# EAGLE design BT AQ DOL STTM R1 (EAGLE 9.6.2)
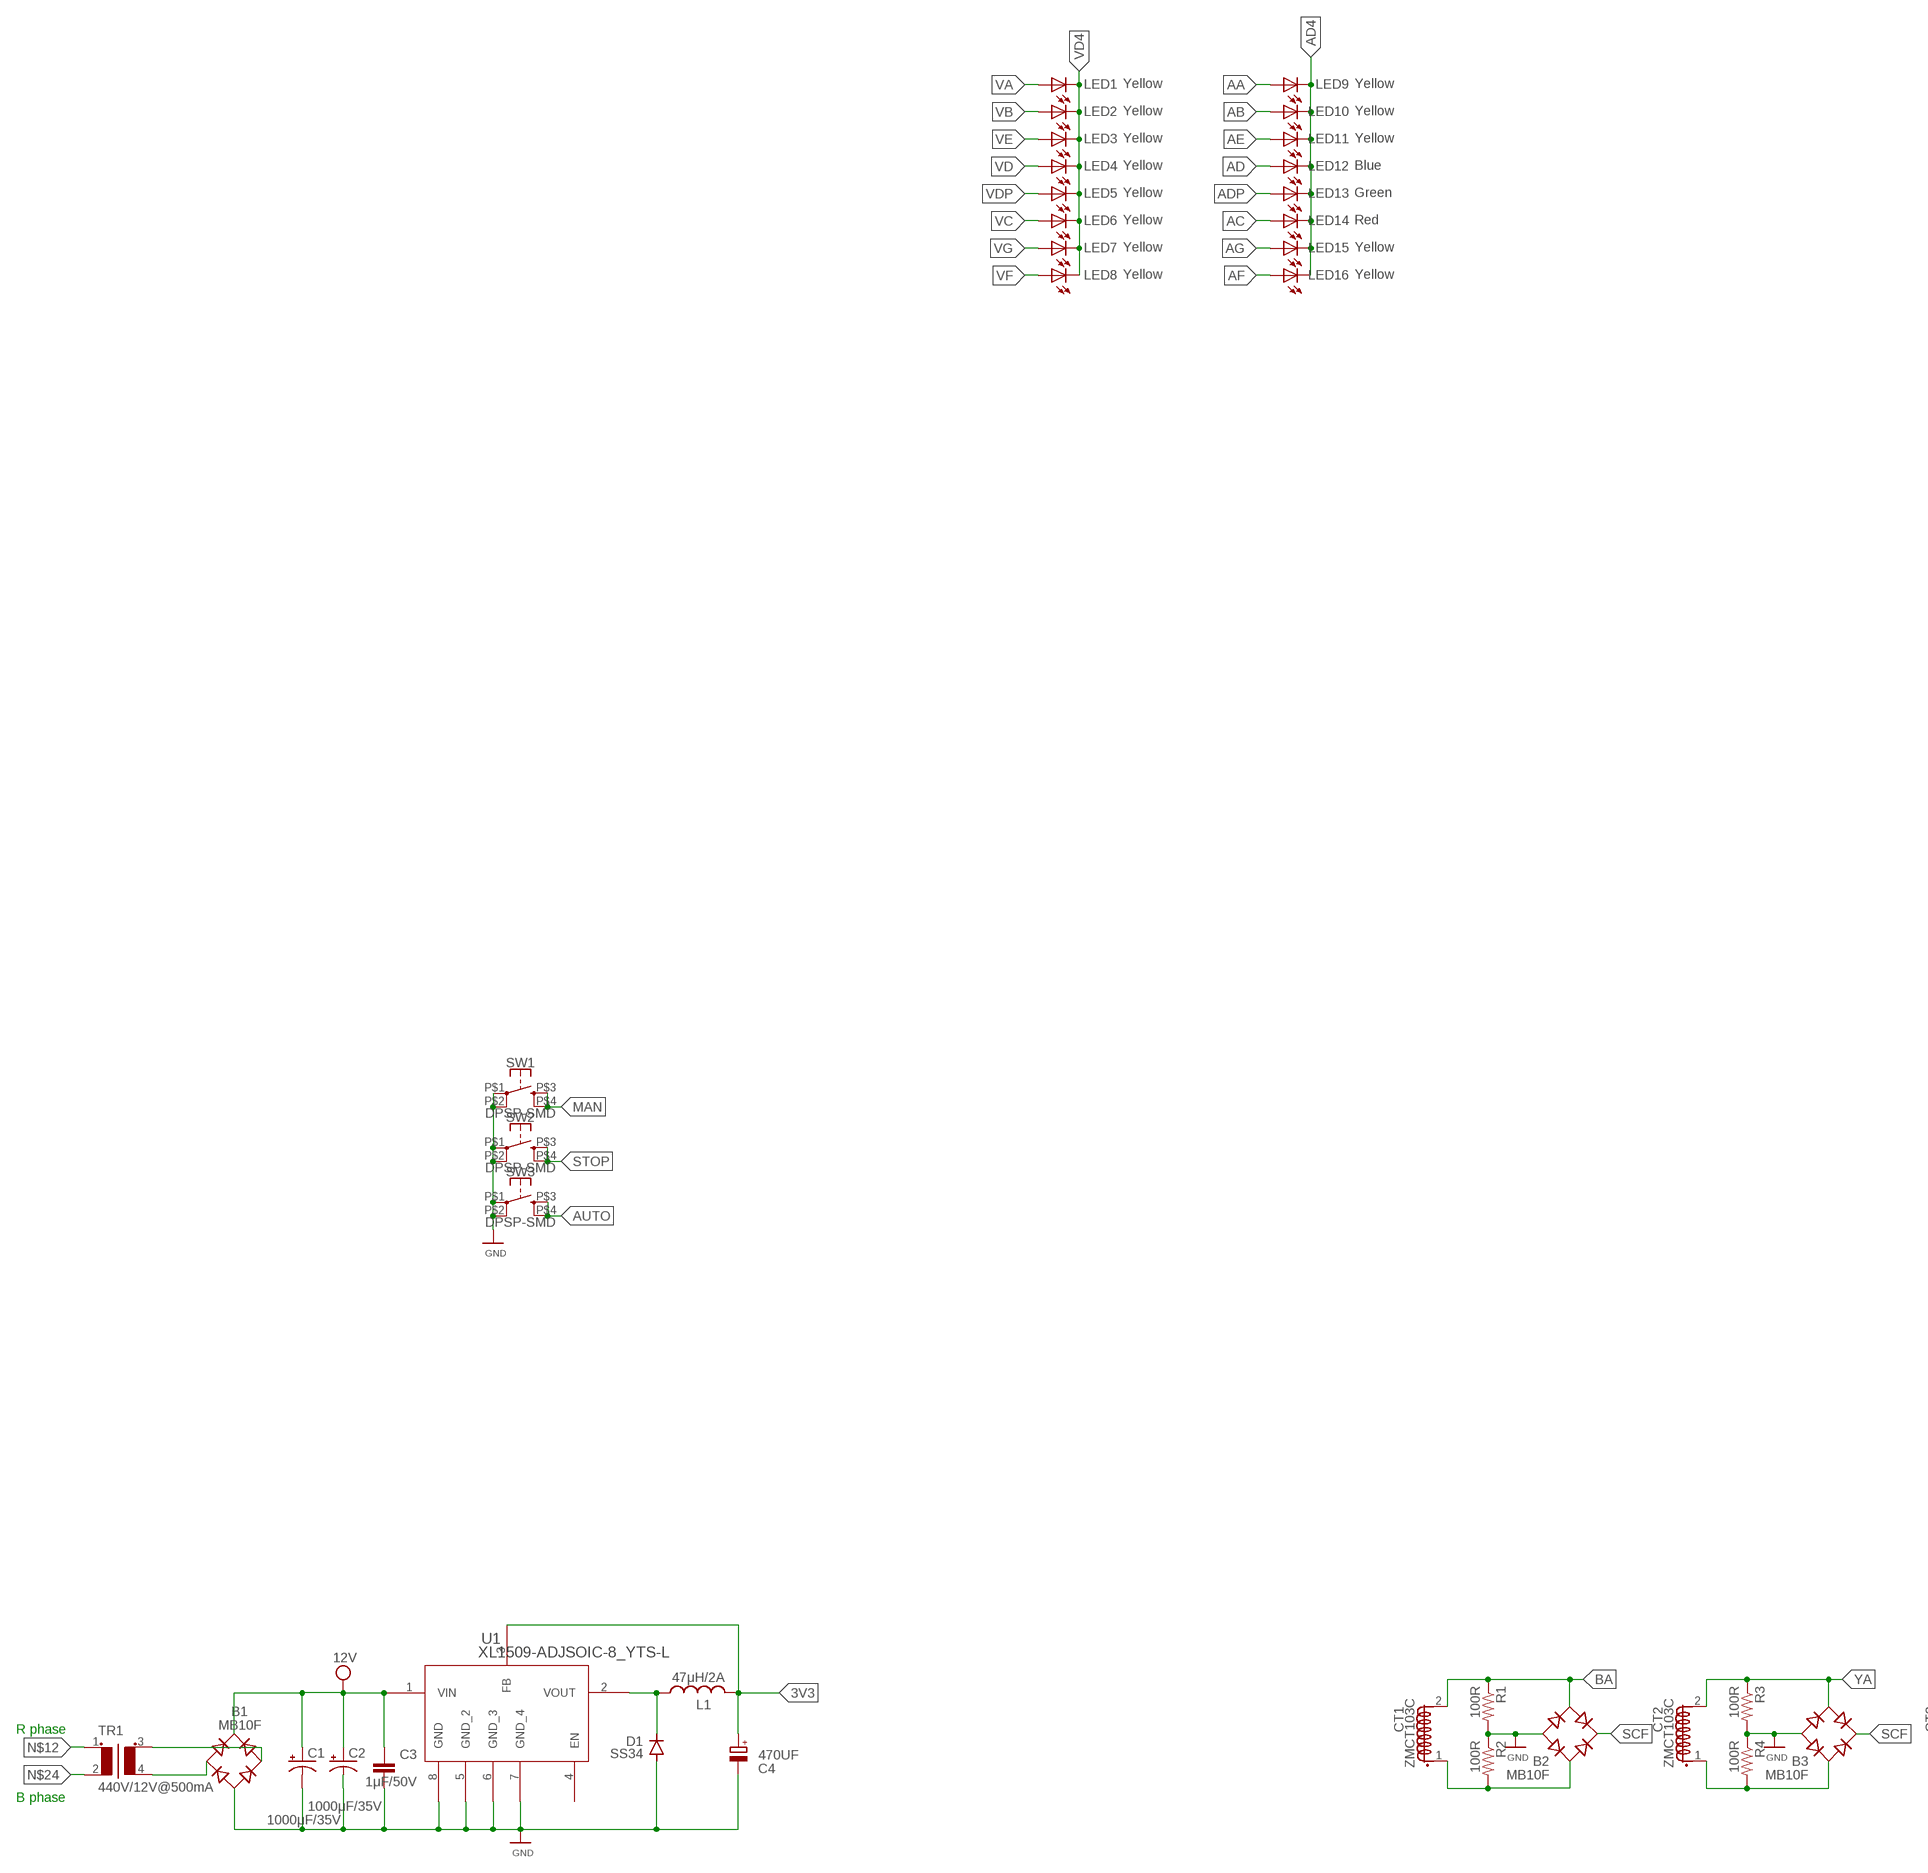
[diagram p0: schematic, sheet 1, part 1 of 2]
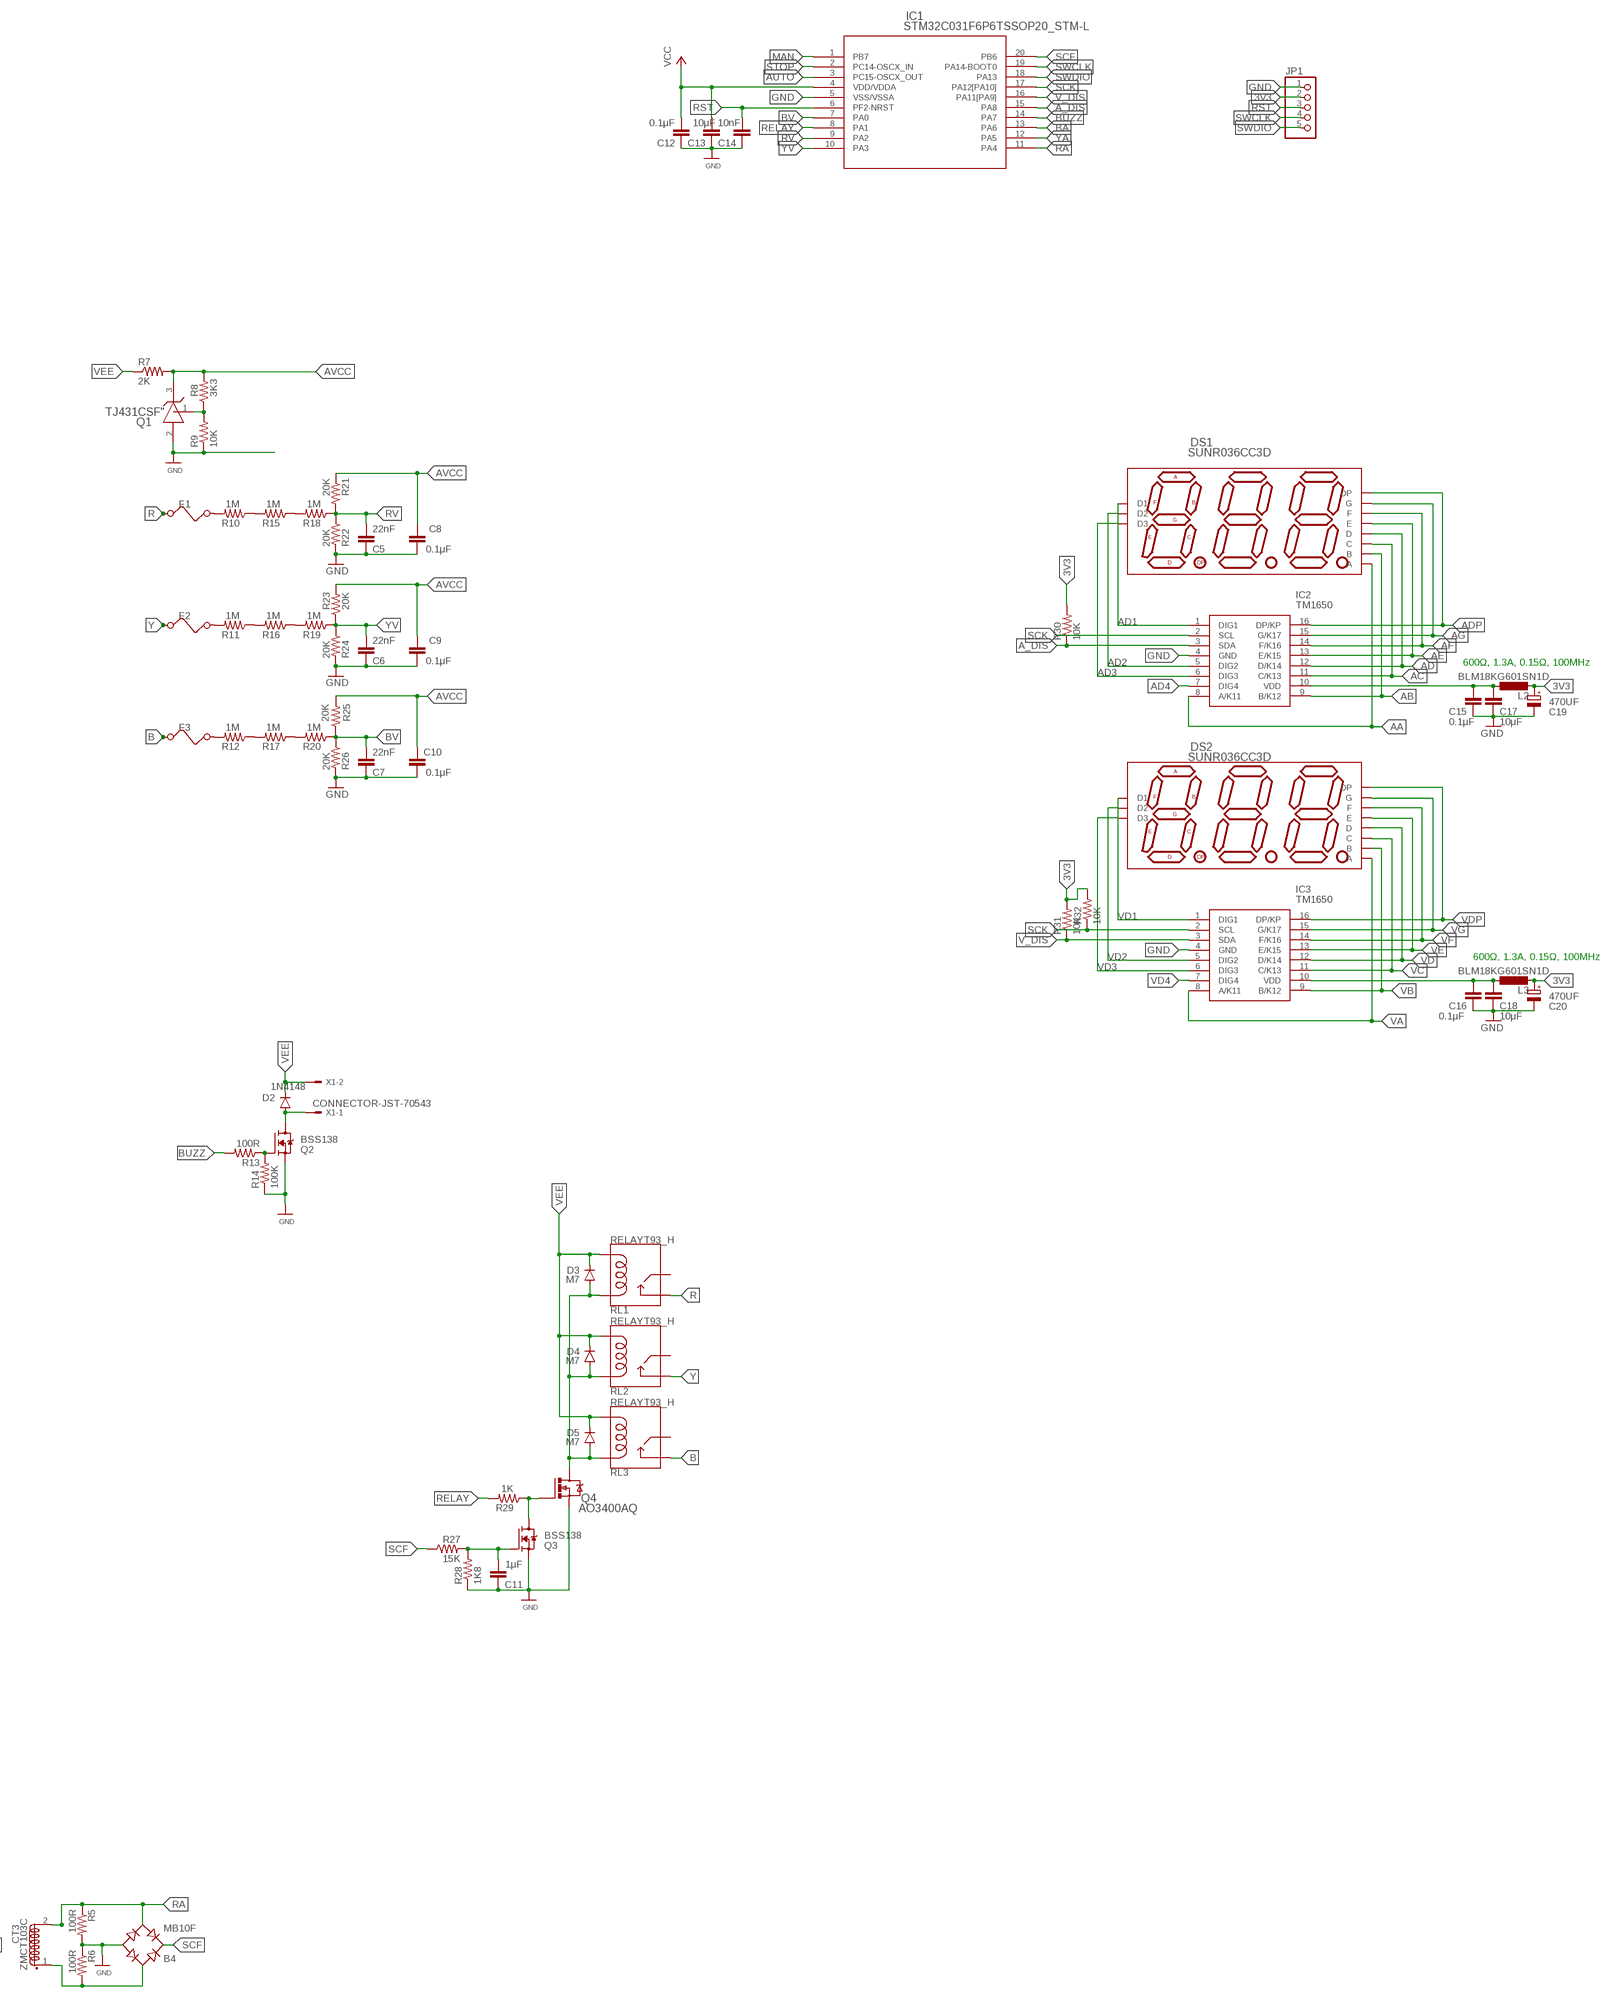
[diagram p1: schematic, sheet 1, part 2 of 2]

## Parts
B1  MB10F  MB8S  [SOIC-4]
B2  MB10F  MB8S  [SOIC-4]
B3  MB10F  MB8S  [SOIC-4]
B4  MB10F  MB8S  [SOIC-4]
C1  1000μF/35V  CPOL-USE5-13  [E5-13]
C2  1000μF/35V  CPOL-USE5-13  [E5-13]
C3  1μF/50V  C-EUC0603K  [C0603K]
C4  470UF  CPOL-EUE3.5-8  [E3,5-8]
C5  22nF  CC1206  [C1206]
C6  22nF  CC1206  [C1206]
C7  22nF  CC1206  [C1206]
C8  0.1μF  CC1206  [C1206]
C9  0.1μF  CC1206  [C1206]
C10  0.1μF  CC1206  [C1206]
C11  1μF  CC1206  [C1206]
C12  0.1μF  C-EUC0603K  [C0603K]
C13  10μF  C-EUC0805K  [C0805K]
C14  10nF  CC1206  [C1206]
C15  0.1μF  C-EUC0603K  [C0603K]
C16  0.1μF  C-EUC0603K  [C0603K]
C17  10μF  C-EUC0805K  [C0805K]
C18  10μF  C-EUC0805K  [C0805K]
C19  470UF  CPOL-EUE3.5-8  [E3,5-8]
C20  470UF  CPOL-EUE3.5-8  [E3,5-8]
CT1  ZMCT103C  CT18X10  [ZMCT103C]
CT2  ZMCT103C  CT18X10  [ZMCT103C]
CT3  ZMCT103C  CT18X10  [ZMCT103C]
D1  SS34  DIODE-DO214AC  [DO214AC]
D2  1N4148  DIODE-MINIMELF  [MINIMELF]
D3  M7  DIODE-DO214AC  [DO214AC]
D4  M7  DIODE-DO214AC  [DO214AC]
D5  M7  DIODE-DO214AC  [DO214AC]
DS1  SUNR036CC3D  7SEGMENT_3DIGIT_DISPLAYDIP  [7S3D036_DIP]
DS2  SUNR036CC3D  7SEGMENT_3DIGIT_DISPLAYDIP  [7S3D036_DIP]
F1  FUSESMD  [WIRE_FUSE]
F2  FUSESMD  [WIRE_FUSE]
F3  FUSESMD  [WIRE_FUSE]
IC1  STM32C031F6P6TSSOP20_STM-L  [TSSOP20_STM-L]
IC2  TM1650  [SOIC127P604X185-16N]
IC3  TM1650  [SOIC127P604X185-16N]
JP1  PINHD-1X5  [1X05]
L1  47μH/2A  INDUCTORL5650M  [L5650M]
L2  BLM18KG601SN1D  L-EUL2012C  [L2012C]
L3  BLM18KG601SN1D  L-EUL2012C  [L2012C]
LED1  Yellow  LED3MM  [LED3MM]
LED2  Yellow  LED3MM  [LED3MM]
LED3  Yellow  LED3MM  [LED3MM]
LED4  Yellow  LED3MM  [LED3MM]
LED5  Yellow  LED3MM  [LED3MM]
LED6  Yellow  LED3MM  [LED3MM]
LED7  Yellow  LED3MM  [LED3MM]
LED8  Yellow  LED3MM  [LED3MM]
LED9  Yellow  LED3MM  [LED3MM]
LED10  Yellow  LED3MM  [LED3MM]
LED11  Yellow  LED3MM  [LED3MM]
LED12  Blue  LED3MM  [LED3MM]
LED13  Green  LED3MM  [LED3MM]
LED14  Red  LED3MM  [LED3MM]
LED15  Yellow  LED3MM  [LED3MM]
LED16  Yellow  LED3MM  [LED3MM]
Q1  TJ431CSF"  [SOT-23]
Q2  BSS138  [SOT95P240X111-3N]
Q3  BSS138  [SOT95P240X111-3N]
Q4  AO3400AQ  [SOT-23-DSG]
R1  100R  R-US_M1206  [M1206]
R2  100R  R-US_M1206  [M1206]
R3  100R  R-US_M1206  [M1206]
R4  100R  R-US_M1206  [M1206]
R5  100R  R-US_M1206  [M1206]
R6  100R  R-US_M1206  [M1206]
R7  2K  R-US_M1206  [M1206]
R8  3K3  R-US_M1206  [M1206]
R9  10K  R-US_M1206  [M1206]
R10  1M  R-US_M1206  [M1206]
R11  1M  R-US_M1206  [M1206]
R12  1M  R-US_M1206  [M1206]
R13  100R  R-US_M1206  [M1206]
R14  100K  R-US_M1206  [M1206]
R15  1M  R-US_M1206  [M1206]
R16  1M  R-US_M1206  [M1206]
R17  1M  R-US_M1206  [M1206]
R18  1M  R-US_M1206  [M1206]
R19  1M  R-US_M1206  [M1206]
R20  1M  R-US_M1206  [M1206]
R21  20K  R-US_M1206  [M1206]
R22  20K  R-US_M1206  [M1206]
R23  20K  R-US_M1206  [M1206]
R24  20K  R-US_M1206  [M1206]
R25  20K  R-US_M1206  [M1206]
R26  20K  R-US_M1206  [M1206]
R27  15K  R-US_M1206  [M1206]
R28  1K8  R-US_M1206  [M1206]
R29  1K  R-US_M1206  [M1206]
R30  10K  R-US_M1206  [M1206]
R31  10K  R-US_M1206  [M1206]
R32  10K  R-US_M1206  [M1206]
RL1  RELAYT93_H  [T93_H]
RL2  RELAYT93_H  [T93_H]
RL3  RELAYT93_H  [T93_H]
SW1  DPSP-SMD  [B3F-40XX-ROUND-SMD]
SW2  DPSP-SMD  [B3F-40XX-ROUND-SMD]
SW3  DPSP-SMD  [B3F-40XX-ROUND-SMD]
TR1  440V/12V@500mA  TRANSFORMER6VA  [440V12V6VA]
U1  XL1509-ADJSOIC-8_YTS-L  [SOIC-8_YTS-L]
X1  CONNECTOR-JST-70543  [70543-02]

## Nets
3V3: C4.+ C12.2 C13.2 C19.+ C20.+ IC1.4(VDD/VDDA) JP1.2 L1.2 L2.2 L3.2 R30.2 R31.2 R32.2 U1.3(FB) ; supply symbol labelled VCC
A_DIS: IC1.15(PA8) IC2.3(SDA) R30.1
AA: DS1.11(A) IC2.8(A/K11) LED9.A
AB: DS1.7(B) IC2.9(B/K12) LED10.A
AC: DS1.4(C) IC2.11(C/K13) LED14.A
AD: DS1.2(D) IC2.12(D/K14) LED12.A
AD1: DS1.12(D1) IC2.1(DIG1)
AD2: DS1.9(D2) IC2.5(DIG2)
AD3: DS1.8(D3) IC2.6(DIG3)
AD4: IC2.7(DIG4) LED9.K(C) LED10.K(C) LED11.K(C) LED12.K(C) LED13.K(C) LED14.K(C) LED15.K(C) LED16.K(C)
ADP: DS1.3(DP) IC2.16(DP/KP) LED13.A
AE: DS1.1(E) IC2.13(E/K15) LED11.A
AF: DS1.10(F) IC2.14(F/K16) LED16.A
AG: DS1.5(G) IC2.15(G/K17) LED15.A
AUTO: IC1.3(PC15-OSCX_OUT) SW3.P$3 SW3.P$4
AVCC: C8.2 C9.2 C10.2 Q1.3(CATHODE) R7.2 R8.2 R21.1 R23.2 R25.2
B: F3.1 RL3.14(N0)
BA: B2.~2(AC2) CT1.2(S1.2) IC1.13(PA6) R1.1
BUZZ: IC1.14(PA7) R13.2
BV: C7.2 IC1.7(PA0) R20.1 R25.1 R26.1
GND: B1.- B2.- B3.- B4.- C1.- C2.- C3.1 C4.- C5.1 C6.1 C7.1 C8.1 C9.1 C10.1 C11.1 C12.1 C13.1 C14.2 C15.1 C16.1 C17.1 C18.1 C19.- C20.- D1.A IC1.5(VSS/VSSA) IC2.4(GND) IC3.4(GND) JP1.1 Q1.2(ANODE) Q2.2(S) Q3.2(S) Q4.S R1.2 R2.1 R3.2 R4.1 R5.2 R6.1 R9.1 R14.1 R22.2 R24.2 R26.2 R28.1 SW1.P$1 SW1.P$2 SW2.P$1 SW2.P$2 SW3.P$1 SW3.P$2 U1.5(GND_2) U1.6(GND_3) U1.7(GND_4) U1.8(GND)
MAN: IC1.1(PB7) SW1.P$3 SW1.P$4
N$1: R15.1 R18.2
N$2 [VEE]: B1.~1(AC1) TR1.4(S2)
N$3: C15.2 C17.2 IC2.10(VDD) L2.1
N$4: Q2.1(G) R13.1 R14.2
N$5: R17.1 R20.2
N$6: Q3.3(D) Q4.G R29.1
N$8: C16.2 C18.2 IC3.10(VDD) L3.1
N$9: D2.A Q2.3(D) X1.1
N$10 [VEE]: B1.~2(AC2) TR1.3(S1)
N$11: R10.1 R15.2
N$12: F1.2 R10.2 TR1.1
N$14: R11.1 R16.2
N$15: R12.1 R17.2
N$16: B2.~1(AC1) CT1.1(S1.1) R2.2
N$17 [VEE]: D3.A D4.A D5.A Q4.D RL1.A1(COIL1) RL2.A1(COIL1) RL3.A1(COIL1)
N$19: R16.1 R19.2
N$20: D1.C L1.1 U1.2(VOUT)
N$21: Q1.1(REF) R8.1 R9.2
N$22: F2.2 R11.2
N$24: F3.2 R12.2 TR1.2
N$25: C11.2 Q3.1(G) R27.2 R28.2
N$27: B3.~1(AC1) CT2.1(S1.1) R4.2
N$62: B4.~1(AC1) CT3.1(S1.1) R6.2
R: F1.1 RL1.14(N0)
RA: B4.~2(AC2) CT3.2(S1.2) IC1.11(PA4) R5.1
RELAY: IC1.8(PA1) R29.2
RST: C14.1 IC1.6(PF2-NRST) JP1.3
RV: C5.2 IC1.9(PA2) R18.1 R21.2 R22.1
SCF: B2.+ B3.+ B4.+ IC1.20(PB6) R27.1
SCK: IC1.17(PA12[PA10]) IC2.2(SCL) IC3.2(SCL) R32.1
STOP: IC1.2(PC14-OSCX_IN) SW2.P$3 SW2.P$4
SWCLK: IC1.19(PA14-BOOT0) JP1.4
SWDIO: IC1.18(PA13) JP1.5
V_DIS: IC1.16(PA11[PA9]) IC3.3(SDA) R31.1
VA: DS2.11(A) IC3.8(A/K11) LED1.A
VB: DS2.7(B) IC3.9(B/K12) LED2.A
VC: DS2.4(C) IC3.11(C/K13) LED6.A
VD: DS2.2(D) IC3.12(D/K14) LED4.A
VD1: DS2.12(D1) IC3.1(DIG1)
VD2: DS2.9(D2) IC3.5(DIG2)
VD3: DS2.8(D3) IC3.6(DIG3)
VD4: IC3.7(DIG4) LED1.K(C) LED2.K(C) LED3.K(C) LED4.K(C) LED5.K(C) LED6.K(C) LED7.K(C) LED8.K(C)
VDP: DS2.3(DP) IC3.16(DP/KP) LED5.A
VE: DS2.1(E) IC3.13(E/K15) LED3.A
VEE [VEE]: B1.+ C1.+ C2.+ C3.2 D2.C D3.C D4.C D5.C R7.1 RL1.A2(COIL2) RL2.A2(COIL2) RL3.A2(COIL2) U1.1(VIN) X1.2 ; supply symbol labelled 12V
VF: DS2.10(F) IC3.14(F/K16) LED8.A
VG: DS2.5(G) IC3.15(G/K17) LED7.A
Y: F2.1 RL2.14(N0)
YA: B3.~2(AC2) CT2.2(S1.2) IC1.12(PA5) R3.1
YV: C6.2 IC1.10(PA3) R19.1 R23.1 R24.1
Unconnected: RL1.11(MAIN) RL2.11(MAIN) RL3.11(MAIN) U1.4(EN)

## Notes on the sheet
- 600Ω, 1.3A, 0.15Ω, 100MHz
- 600Ω, 1.3A, 0.15Ω, 100MHz
- R phase
- B phase

## Library data of the parts
B1-B4 = rectifier:MB*S: Bridge Rectifier Source: http://www.fairchildsemi.com/ds/MB/MB6S.pdf
C1 C2 = User Components:CPOL-US: POLARIZED CAPACITOR, American symbol
C3 C12 C13 C15-C18 = rcl:C-EU: CAPACITOR, European symbol; SPICEPREFIX: C
C4 C19 C20 = rcl:CPOL-EU: POLARIZED CAPACITOR, European symbol; SPICEPREFIX: C
C5-C11 C14 = eagle-ltspice:C: CAPACITOR, European symbol; SPICEMODEL: NONE; SPICEPREFIX: C
CT1-CT3 = User Components:CT
D1-D5 = diode:DIODE-: DIODE
DS1 DS2 = User Components:7SEGMENT_3DIGIT_DISPLAY
F1-F3 = User Components:FUSE: FUSE 5 x 20 mm
IC1 = User Components:STM32C031F6P6; COPYRIGHT: Copyright (C) 2026 Ultra Librarian. All rights reserved.; DATASHEET: https://www.st.com/resource/en/datasheet/stm32c031c4.pdf; DESCRIPTION: Mainstream Arm Cortex-M0+ MCU with 32 Kbytes of Flash memory, 12 Kbytes RAM, 48 MHz CPU, 2x USART, timers, ADC, comm. I/F, 2-3.6V; MANUFACTURER_NAME: STMicroelectronics; MANUFACTURER_PART_NUMBER: STM32C031F6P6
IC2 IC3 = User Components:TM1650: The TM1650 is a dedicated LED (LED display) drive control circuit with a keyboard scan interface. The MCU input and output control digital interface, data latch, LED driver, keyboard scan, brightness adjustment and other circuits are integrated inside. The TM1650's stable performance, reliable quality, and high immunity to interference make it suitable for long-term continuous operation in 24 hours Source: Datasheet <http://www.titanmec.com/index.php/en/product/download/id/540.html>; DESCRIPTION: The TM1650 is a dedicated LED (LED display) drive control circuit with a keyboard scan interface. The MCU input and output control digital interface, data latch, LED driver, keyboard scan, brightness adjustment and other circuits are integrated inside. The TM1650's stable performance, reliable quality, and high immunity to interference make it suitable for long-term continuous operation in 24 hours; HEIGHT: 1.85mm; MANUFACTURER_NAME: TITAN MICRO ELECTRONICS; MANUFACTURER_PART_NUMBER: tm1650
JP1 = User Components:PINHD-1X5: PIN HEADER
L1 = User Components:INDUCTOR: INDUCTOR, American symbol; SPICEPREFIX: L
L2 L3 = rcl:L-EU: INDUCTOR, European symbol; SPICEPREFIX: L
LED1-LED16 = adafruit:LED: LED OSRAM: - CHIPLED LG R971, LG N971, LY N971, LG Q971, LY Q971, LO R971, LY R971 LH N974, LH R974 LS Q976, LO Q976, LY Q976 LO Q996 - Hyper CHIPLED LW Q18S LB Q993, LB Q99A, LB R99A - SideLED LS A670, LO A670, LY A670, LG A670, LP A670 LB A673, LV A673, LT A673, LW A673 LH A674 LY A675 LS A676, LA A676, LO A676, LY A676, LW A676 LS A679, LY A679, LG A679 - Hyper Micro SIDELED® LS Y876, LA Y876, LO Y876, LY Y876 LT Y87S - SmartLED LW L88C, LW L88S LB L89C, LB L89S, LG L890 LS L89K, LO L89K, LY L89K LS L896, LA L896, LO L896, LY L896 - TOPLED LS T670, LO T670, LY T670, LG T670, LP T670 LSG T670, LSP T670, LSY T670, LOP T670, LYG T670 LG T671, LOG T671, LSG T671 LB T673, LV T673, LT T673, LW T673 LH T674 LS T676, LA T676, LO T676, LY T676, LB T676, LH T676, LSB T676, LW T676 LB T67C, LV T67C, LT T67C, LS T67K, LO T67K, LY T67K, LW E67C LS E67B, LA E67B, LO E67B, LY E67B, LB E67C, LV E67C, LT E67C LW T67C LS T679, LY T679, LG T679 LS T770, LO T770, LY T770, LG T770, LP T770 LB T773, LV T773, LT T773, LW T773 LH T774 LS E675, LA E675, LY E675, LS T675 LS T776, LA T776, LO T776, LY T776, LB T776 LHGB T686 LT T68C, LB T68C - Hyper Mini TOPLED® LB M676 - Mini TOPLED Santana® LG M470 LS M47K, LO M47K, LY M47K Source: http://www.osram.convergy.de/
Q1 = User Components:TJ431CSF; COPYRIGHT: Copyright (C) 2022 Ultra Librarian. All rights reserved.; MANUFACTURER_PART_NUMBER: TL431IDBZTG4; MFR_NAME: Texas Instruments; REFDES: RefDes; TYPE: TYPE
Q2 Q3 = User Components:BSS138: Check availability <https://pricing.snapeda.com/parts/BSS138/onsemi/view-part?ref=eda>; AVAILABILITY: In Stock; CHECK_PRICES: https://www.snapeda.com/parts/BSS138/Onsemi/view-part/?ref=eda; DESCRIPTION: N-Channel 50 V 220mA (Ta) 350mW (Ta) Surface Mount SOT-23-3; MF: onsemi; MP: BSS138; PACKAGE: SOT-23-3 ON Semiconductor; PRICE: None; SNAPEDA_LINK: https://www.snapeda.com/parts/BSS138/Onsemi/view-part/?ref=snap
Q4 = User Components:AO3400A; COPYRIGHT: Copyright (C) 2024 Ultra Librarian. All rights reserved.; MANUFACTURER_PART_NUMBER: AO3400A; MFR_NAME: Alpha and Omega Semiconductor
R1-R9 R14 R27 R28 = rcl:R-US_: RESISTOR, American symbol
R10-R13 R15-R26 R29-R32 = rcl:R-US_: RESISTOR, American symbol; SPICEPREFIX: R
RL1-RL3 = User Components:RELAY
SW1-SW3 = User Components:DPSP-SMD
TR1 = User Components:TRANSFORMER
U1 = User Components:XL1509-ADJ; COPYRIGHT: Copyright (C) 2026 Ultra Librarian. All rights reserved.; MANUFACTURER_NAME: UMW(Youtai Semiconductor Co., Ltd.); MANUFACTURER_PART_NUMBER: XL1509-ADJ
X1 = User Components:CONNECTOR-JST: CONNECTOR wire to board 2.54 mm (0.100") pitch header; MF: MOLEX; OC_FARNELL: unknown; OC_NEWARK: unknown

## Net classes
0 default: width 0.254 mm, drill 0.508 mm, clearance 0.33 mm
1 VEE: width 0.508 mm, drill 0.508 mm, clearance 0.762 mm

## Board
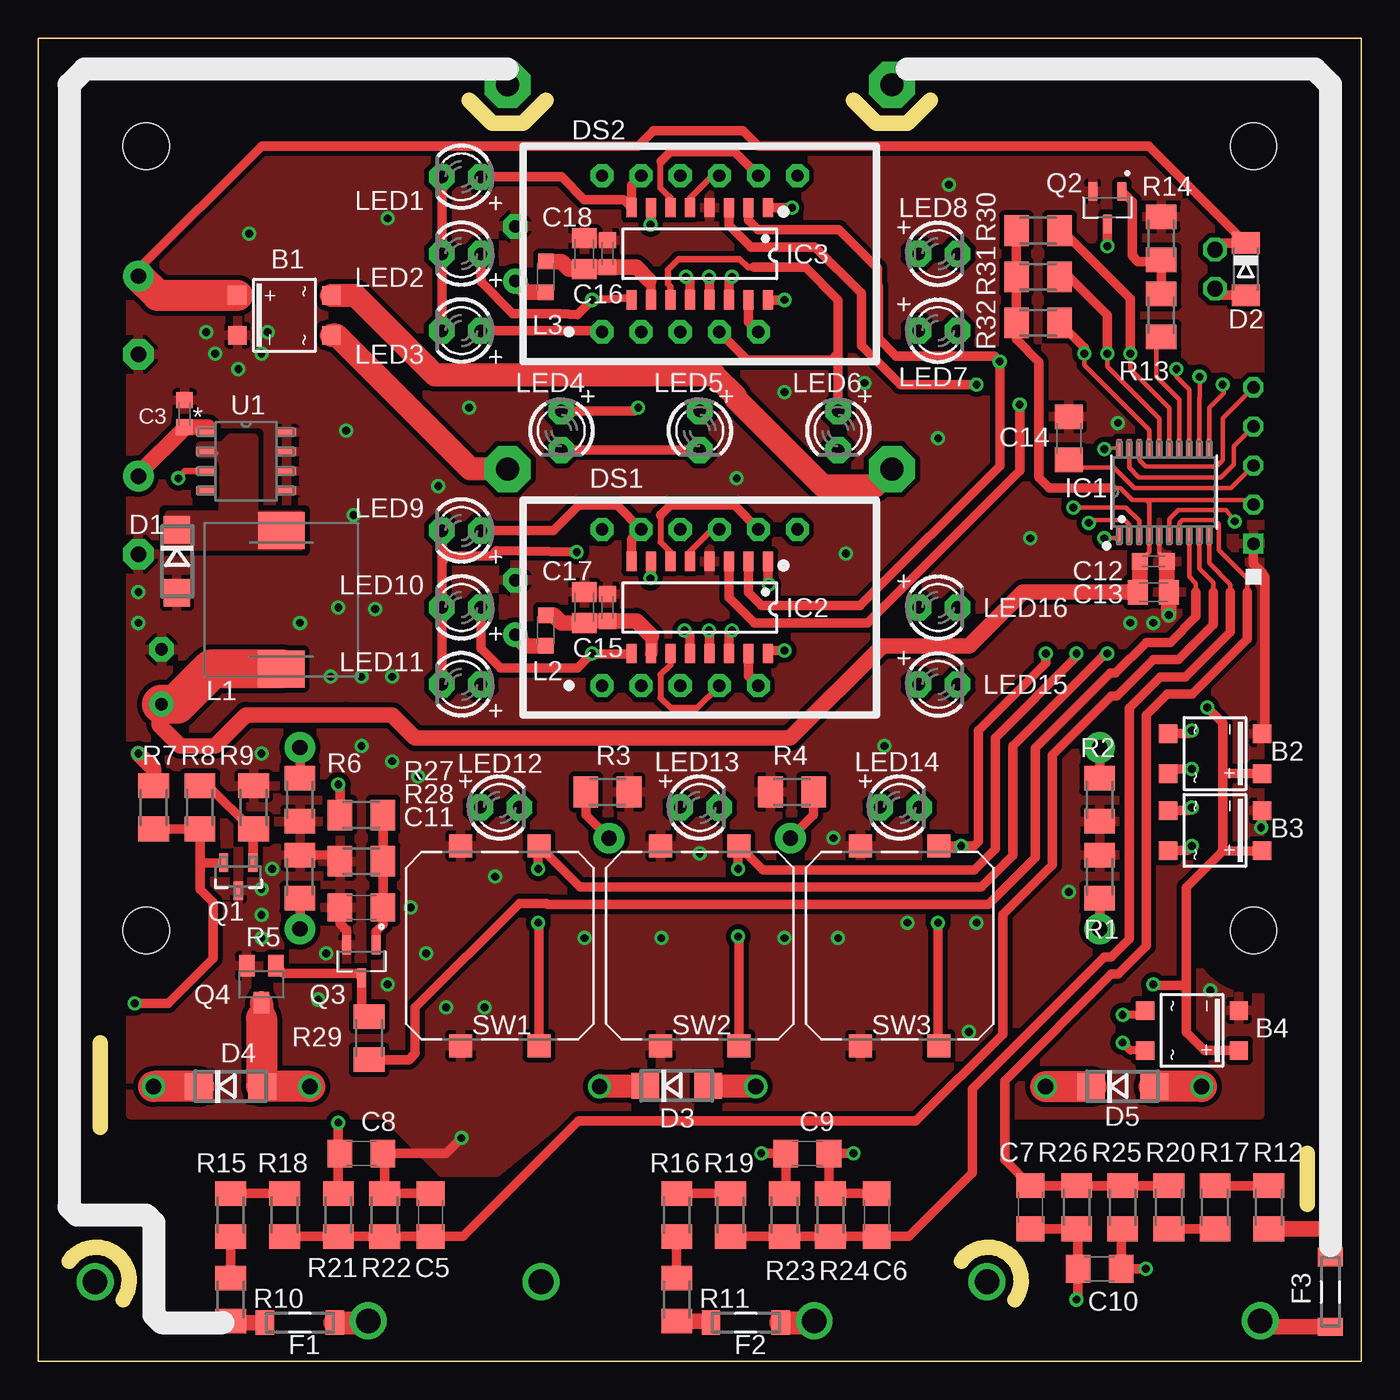
[diagram p2: board, top side]
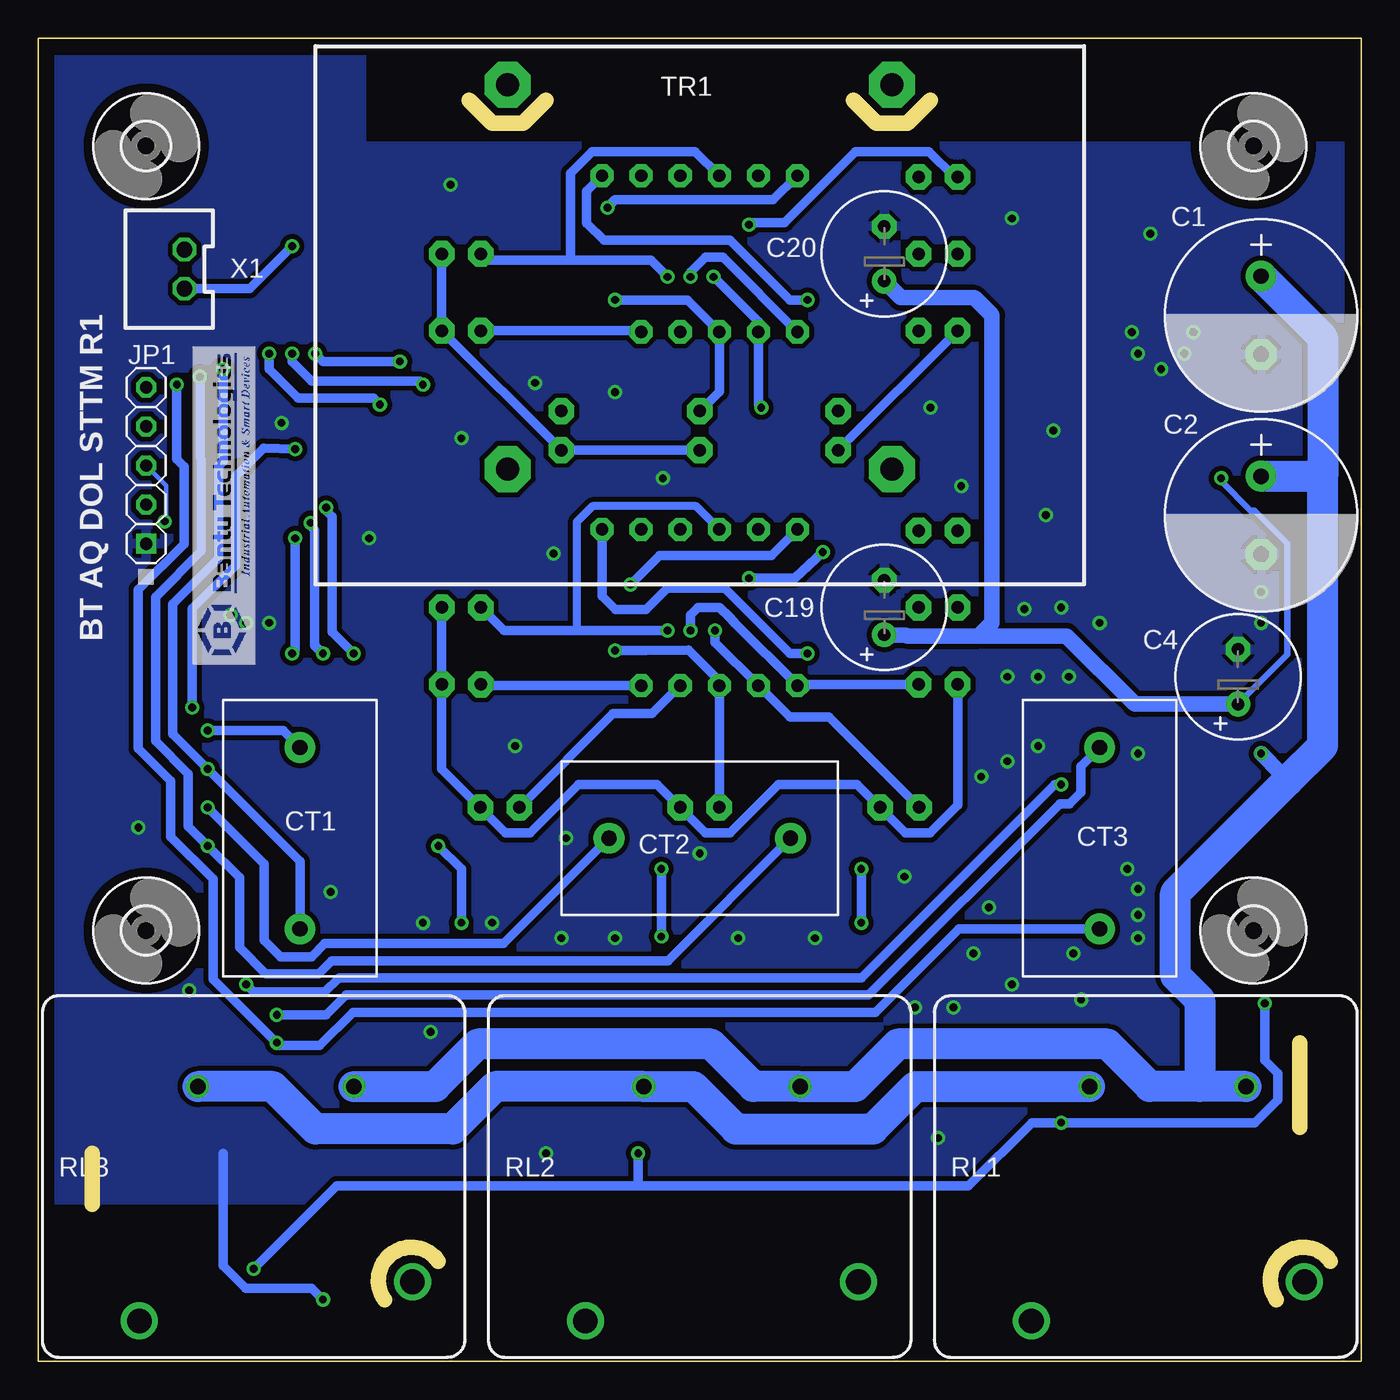
[diagram p3: board, bottom side, seen from below]

Size 86 x 86 mm. Coordinates in mm from the lower left corner, seen from the top.
Outline: 86,0 86,86 0,86 0,0 86,0
Copper layers (1*16): Top 0.035mm / dielectric 1.5mm / Bottom 0.035mm
Design rules "default *": minimum track width 6mil, minimum drill 0.35mm, track to track 6mil, track to pad 6mil, pad to pad 6mil, via to via 6mil, smd to smd 6mil, copper to edge 40mil, drill to drill 6mil, minimum pad ring 10mil, minimum via ring 8mil, stop-mask expansion 4mil, vias tented up to drill 20mil, thermal gap 10mil
Milling: 10 lines

### Footprints (pad centres in the part's own frame; a part is rotated, then mirrored left to right if it is on the bottom)
SOIC-4 = smd 1.2 x 1.2: + 1.3,3.05; - -1.3,3.05; ~1 -1.3,-3.05; ~2 1.3,-3.05
E5-13 = drill 1 pad 2: + -2.54,0 | drill 1 pad 2 octagon: - 2.54,0
C0603K = smd 1.05 x 1.08: 1 -0.875,0; 2 0.875,0
E3,5-8 = drill 0.813 pad 1.6: + -1.778,0 | drill 0.813 pad 1.6 octagon: - 1.778,0
C1206 = smd 1.6 x 1.8: 1 -1.4,0; 2 1.4,0
C0805K = smd 1.3 x 1.6: 1 -1,0; 2 1,0
ZMCT103C = drill 1 pad 2: 1 -5.9,0; 2 5.9,0
DO214AC = smd 1.8 x 1.7: A 2.05,0; C -2.05,0
MINIMELF = smd 1.4 x 1.8: A 1.7,0; C -1.7,0
7S3D036_DIP = drill 0.8 pad 1.5 octagon: 1 -6.35,-5.08; 2 -3.81,-5.08; 3 -1.27,-5.08; 4 1.27,-5.08; 5 3.81,-5.08; 7 6.35,5.08; 8 3.81,5.08; 9 1.27,5.08; 10 -1.27,5.08; 11 -3.81,5.08; 12 -6.35,5.08
WIRE_FUSE = smd 1.2 x 1.6: 1 -2.27,0; 2 2.27,0
TSSOP20_STM-L = smd 1.162 x 0.305: 1 -2.871,2.925; 2 -2.871,2.275; 3 -2.871,1.625; 4 -2.871,0.975; 5 -2.871,0.325; 6 -2.871,-0.325; 7 -2.871,-0.975; 8 -2.871,-1.625; 9 -2.871,-2.275; 10 -2.871,-2.925; 11 2.871,-2.925; 12 2.871,-2.275; 13 2.871,-1.625; 14 2.871,-0.975; 15 2.871,-0.325; 16 2.871,0.325; 17 2.871,0.975; 18 2.871,1.625; 19 2.871,2.275; 20 2.871,2.925
SOIC127P604X185-16N = smd 1.25 x 0.65: 1 -3,4.445; 2 -3,3.175; 3 -3,1.905; 4 -3,0.635; 5 -3,-0.635; 6 -3,-1.905; 7 -3,-3.175; 8 -3,-4.445; 9 3,-4.445; 10 3,-3.175; 11 3,-1.905; 12 3,-0.635; 13 3,0.635; 14 3,1.905; 15 3,3.175; 16 3,4.445
1X05 = drill 0.8 square: 1 -6.35,0 | drill 0.8 octagon: 2 -3.81,0; 3 -1.27,0; 4 1.27,0; 5 3.81,0
L5650M = smd 2.4 x 3: 1 -4.5,0; 2 4.5,0
L2012C = smd 1 x 1: 1 -1,0; 2 1,0
LED3MM = drill 0.813 pad 1.676 octagon: A -1.27,0; K 1.27,0
SOT-23 = smd 0.6 x 1.2: 1 -0.95,-0.9; 2 0,0.9; 3 0.95,-0.9
SOT95P240X111-3N = smd 1.23 x 0.6: 1 -1.06,0.95; 2 -1.06,-0.95; 3 1.06,0
SOT-23-DSG = smd 1 x 1.4: D 0,1.2; G -0.95,-1.2; S 0.95,-1.2
M1206 = smd 1.6 x 2: 1 -1.4,0; 2 1.4,0
T93_H = drill 1.6: 11 10.32,-6.85; 14 -7.44,-9.39 | drill 1: A1 -3.64,5.85; A2 6.52,5.85
B3F-40XX-ROUND-SMD = smd 1.5 x 1.5: P$1 -6.5,2.54; P$2 6.5,2.54; P$3 -6.5,-2.54; P$4 6.5,-2.54
440V12V6VA = drill 1.5 pad 3 octagon: 1 -12.5,12.5; 2 -12.5,-12.5; 3 12.5,-12.5; 4 12.5,12.5
SOIC-8_YTS-L = smd 1.194 x 0.508: 1 -2.654,1.905; 2 -2.654,0.635; 3 -2.654,-0.635; 4 -2.654,-1.905; 5 2.654,-1.905; 6 2.654,-0.635; 7 2.654,0.635; 8 2.654,1.905
3,0 = hole 3: 0,0
70543-02 = drill 1.016 octagon: 1 -1.27,-1; 2 1.27,-1

### Placement (x,y rotation side)
B1  16,68 90 top
B2  76.5,39.5 270 top
B3  76.5,34.5 270 top
B4  75,21.5 270 top
C1  6.5,68 270 bottom
C2  6.5,55 270 bottom
C3  9.5,61.6 270 top
C4  8,44.5 90 bottom
C5  25.5,9.5 270 top
C6  54.5,9.5 270 top
C7  64.5,10 90 top
C8  21,13.5 180 top
C9  50,13.5 180 top
C10  69,6 0 top
C11  21,29.5 0 top
C12  72.5,52 180 top
C13  72.5,50 180 top
C14  67,60 90 top
C15  37,49 270 top
C16  37,72 270 top
C17  35.5,49 270 top
C18  35.5,72 270 top
C19  31,49 90 bottom
C20  31,72 90 bottom
CT1  69,34 270 bottom
CT2  43,34 0 bottom
CT3  17,34 270 bottom
D1  9,52 270 top
D2  78.5,71 270 top
D3  41.5,17.9 0 top
D4  12.5,17.85 0 top
D5  70.5,17.85 0 top
DS1  43,49 0 top
DS2  43,72 0 top
F1  17,2.5 180 top
F2  46,2.5 180 top
F3  84,4.5 90 top
IC1  73.2,56.5 90 top
IC2  43,49 270 top
IC3  43,72 270 top
JP1  79,59.5 90 bottom
L1  15.8,49.5 270 top
L2  33,47.5 270 top
L3  33,70.5 270 top
LED1  27.5,77 180 top
LED2  27.5,72 180 top
LED3  27.5,67 180 top
LED4  34,60.5 270 top
LED5  43,60.5 270 top
LED6  52,60.5 270 top
LED7  58.5,67 0 top
LED8  58.5,72 0 top
LED9  27.5,54 180 top
LED10  27.5,49 180 top
LED11  27.5,44 180 top
LED12  30,36 0 top
LED13  43,36 0 top
LED14  56,36 0 top
LED15  58.5,44 0 top
LED16  58.5,49 0 top
Q1  13,31.5 180 top
Q2  69.5,75 270 top
Q3  21,26 270 top
Q4  14.5,24.5 180 top
R1  69,31.5 90 top
R2  69,36.5 90 top
R3  37,37 0 top
R4  49,37 0 top
R5  17,31.5 90 top
R6  17,36.5 90 top
R7  7.5,36 270 top
R8  10.5,36 270 top
R9  14,36 270 top
R10  12.5,4 270 top
R11  41.5,4 270 top
R12  80,10 270 top
R13  73,68 270 top
R14  73,73 270 top
R15  12.5,9.5 270 top
R16  41.5,9.5 270 top
R17  76.5,10 90 top
R18  16,9.5 90 top
R19  45,9.5 90 top
R20  73.5,10 270 top
R21  19.5,9.5 270 top
R22  22.5,9.5 90 top
R23  48.5,9.5 90 top
R24  51.5,9.5 90 top
R25  70.5,10 270 top
R26  67.5,10 270 top
R27  21,35.5 0 top
R28  21,32.5 0 top
R29  21.5,21 270 top
R30  65,73.5 180 top
R31  65,70.5 180 top
R32  65,67.5 180 top
RL1  14,12 0 bottom
RL2  43,12 0 bottom
RL3  72,12 0 bottom
SW1  30,27 90 top
SW2  43,27 90 top
SW3  56,27 90 top
TR1  43,70.5 270 bottom
U1  13.5,58.5 0 top
U$5  [3,0]  79,79 0 bottom
U$6  [3,0]  7,79 0 bottom
U$17  [3,0]  7,28 0 bottom
U$29  [3,0]  79,28 0 bottom
X1  77.5,71 90 bottom

### Tracks (layer width: path | path; a pad name or v marks a point on that pad's centre or on a via)
3V3  (via drill 0.51)
  Top 0.305: C12.2 72.22,52.6 IC1.4 72.22,55.77 72,56 | C4.+ 7.86,42.86 | JP1.2 78.69,56 72,56 | 69.83,56.77 70.35,56.77 71.12,56 72,56
  Top 0.406: U1.3 9.5,57.87 9.1,57.47 v9.1,57.4
  Top 0.61: R30.2 R31.2 R32.2 63.6,66.43 65.07,64.97 65.07,57.43 65.73,56.77 69.83,56.77
  Top 1: L2.2 31.72,46.5 C19.+ | L3.2 31.72,69.5 C20.+
  Top 1.016: C12.2 71.62,50.12 C13.2 64,50 60.5,46.5 54.87,46.5 48.87,40.5 24.5,40.5 23,42 20,42 20,42.02 13.5,42.02 11.48,40 9.22,40 7.86,41.36 7.86,42.86
  Top 2.54: C4.+ 9,42.72 11.28,45 L1.2
  Bottom 0.406: v9.1,57.4 9.1,57.23 7.19,55.31 6.93,55.31 4.79,53.17 4.79,45.93 C4.+
  Bottom 1.016: C19.+ 29.61,47.22 29.54,47.15 24.85,47.15 | 24.85,47.15 24,48 24,68 25.15,69.15 29.92,69.15 C20.+ | C4.+ 14.72,42.72 19.15,47.15 24.85,47.15
A_DIS  (via drill 0.51)
  Top 0.305: v71,65.5 71,64.5 73.53,61.98 IC1.15
  Top 0.61: IC2.3 44.91,49.66 46.56,48 53.9,48 63.8,57.91 v63.8,62.2 | v71,65.5 71,69.08 66.58,73.5 R30.1
  Bottom 0.61: v63.8,62.2 64.21,62.61 69.11,62.61 71,64.5 v71,65.5
AA
  Top 0.61: IC2.8 38.55,53.45 DS1.11 37.63,55.64 35.14,55.64 33.5,54 LED9.A
AB  (via drill 0.51)
  Top 0.61: IC2.9 38.55,46.27 38.28,45.99 36.01,45.99 v36,46 35.05,45.05 30.05,45.05 28.77,46.34 LED10.A
  Bottom 0.61: DS1.7 49.35,49.73 48.47,48.86 46.5,48.86 45.09,50.27 41.39,50.27 37.12,46 v36,46
AC
  Top 0.305: 40.46,43.14 40.46,43.12
  Top 0.38: 40.46,44.64 40.46,43.14
  Top 0.406: IC2.11 41.09,45.26 40.46,44.64 | 40.46,43.12 41.12,42.46 42.84,42.46 44.27,43.89 DS1.4
  Bottom 0.61: DS1.4 46.09,42.09 48.63,42.09 LED14.A
AD  (via drill 0.51)
  Top 0.61: v42,47.5 42.37,47.13 IC2.12
  Bottom 0.61: LED12.A 34.59,41.87 37.13,41.87 DS1.2 42,46.73 v42,47.5
AD1  (via drill 0.51)
  Top 0.61: v47.5,50.5 47.45,50.55 IC2.1
  Bottom 0.61: v47.5,50.5 45.62,52.38 38.35,52.38 DS1.12
AD2
  Top 0.406: IC2.5 42.37,52.65 43.8,54.08 DS1.9
AD3
  Top 0.38: 40.46,55.02 40.46,53.25
  Top 0.406: IC2.6 41.09,52.61 40.46,53.25
  Top 0.61: 40.46,55.02 41.08,55.64 45.25,55.64 DS1.8
AD4  (via drill 0.51)
  Top 0.61: LED11.K LED10.K 26.23,52 | 26.23,52 LED9.K | 26.23,52 26.58,52.35 29.45,52.35 29.8,52.7 v35,52.6 | IC2.7 39.83,51.14 v39.8,50.9
  Bottom 0.61: LED11.K 26.23,36.16 28.05,34.35 29.62,34.35 LED12.K 32.77,37.5 37.9,37.5 41.05,34.35 42.62,34.35 LED13.K 45.77,37.5 50.9,37.5 54.05,34.35 55.62,34.35 LED14.K 59.77,38.5 LED15.K LED16.K | v39.8,50.9 36.8,50.9 v35,52.6
ADP  (via drill 0.51)
  Top 0.61: v48.5,46.2 47.65,46.2 IC2.16
  Bottom 0.61: v48.5,46.2 48.49,46.21 46.5,46.21 43.73,46.23 41.73,44.23 DS1.3 LED13.A
AE  (via drill 0.51)
  Top 0.61: IC2.13 43.63,47.37 v43.6,47.5
  Bottom 0.61: v43.6,47.5 43.6,48.5 43.1,49 41.7,49 41.1,48.4 40.73,48.03 | DS1.1 36.65,43.65 36.3,44 LED11.A | DS1.1 40.73,48 40.73,48.03 | 40.73,48.03 36.65,43.95 DS1.1
AF  (via drill 0.51)
  Top 0.61: IC2.14 44.91,47.41 v45.1,47.5
  Bottom 0.508: 51,47.5 51,54.57 49.98,55.59 43.24,55.59 DS1.10
  Bottom 0.61: v45.1,47.5 51,47.5 55.73,47.5 LED16.A
AG
  Top 0.61: IC2.15 46.17,44.55 DS1.5
  Bottom 0.61: LED15.A 57.12,44.12 56.92,43.92 DS1.5
AUTO  (via drill 0.51)
  Top 0.305: IC1.3 71.58,54.64 70.72,55.5 v67.3,55.5
  Top 0.61: v60,33.5 SW3.P$4 60.84,33.5 61.11,33.78 61.11,40.99 65.5,45.38 v65.5,46 | v58.5,28.5 58.5,20.54 SW3.P$3
  Bottom 0.61: v58.5,28.5 58.5,32 v60,33.5 | v67.3,55.5 67.3,55.3 66.91,54.91 66.91,47.41 v65.5,46
AVCC  (via drill 0.51)
  Top 0.61: v47,13.5 C9.2 48.6,11 R23.2 | v19.5,15.5 19.5,13.6 C8.2 19.5,13.4 R21.1 | R7.2 R8.2 10.5,32.5 | 10.5,32.5 10.5,30.68 11.37,29.81 11.37,26.19 8.43,23.25 v6.25,23.25 | R25.2 70.5,8.1 70.4,8 C10.2 v72,6 | Q1.3 10.6,32.4 10.5,32.5
  Bottom 0.61: 47,11.38 25.54,11.38 21.42,15.5 v19.5,15.5 6.91,15.5 5.41,16.99 5.41,18.71 6.25,19.54 v6.25,23.25 | v47,13.5 47,11.38 | v72,6 66.62,11.38 47,11.38
B
  Top 1: F3.1 79.82,2.23 RL3.14
BA  (via drill 0.51)
  Top 0.305: v74,64.5 74,64 74.83,63.17 IC1.13
  Top 0.61: B2.~2 73.75,38.5 v75,38.5 | R1.1 CT1.2
  Bottom 0.61: CT1.2 69,32.5 v75,38.5 77.27,40.77 77.27,49.23 74.3,52.2 74.3,58.19 74,58.48 v74,64.5
BUZZ
  Top 0.305: R13.2 72.69,66.3 72.69,64.01 74.17,62.53 IC1.14
BV
  Top 0.305: IC1.7 74.17,54.5 74.37,54.69 76.48,54.69 76.76,54.41 76.76,52.74 78.62,50.88 78.62,50
  Top 0.61: R20.1 R26.1 R25.1 C7.2 62.83,13.07 62.83,18.22 69.78,25.17 70.21,25.17 72.04,26.99 72.04,42 73.42,43.38 75.04,43.38 78.62,46.96 78.62,50
GND  (via drill 0.51)
  Top 0.305: IC1.5 72.88,52.5 C12.1
  Top 0.61: v53,13.5 C9.1 51.4,11 R24.2 C6.1 | C5.1 R22.2 22.5,13.4 C8.1 26.5,13.5 v27.5,14.5 | C7.1 R26.2 67.6,8.5 C10.1 67.6,4.1 v67.5,4 | Q3.2 20.05,28 19.6,28.45 C11.1 | R5.2 19.2,32.9 R28.1 | B2.- 79.73,40.98 79.73,51 79.58,51.15 79.58,51.28 79,51.87 JP1.1 | B3.- 79.55,34.75 v79.5,34.7
  Top 1.016: C12.1 73.38,50.12 C13.1 v73.5,48.5
  Bottom 0.61: v67.5,4 68.23,4.73 72.53,4.73 74,6.2 74,13.5
  other vias: 52.5,52.5 72.5,48 71,48 53.7,63.6 11.5,65.5 20.5,55 6.5,48 6.5,50 59.2,76.5 22.7,74.3 13.7,73.3 21.9,48.9 14.5,65.5 14.9,66.9 13,64.5 23,44.5 20,60.5 14.5,39.5 26,56.9 19.5,49 17,48 51.7,34 14.5,30.7 18.7,26.5 14.5,29 18.2,23.5 14.5,27.5 26.5,23 25.2,26.5 22.7,24.5 24.2,29.5 29.7,31.5 24.7,38 23,39 21,40 29,23 35.5,27.5 40.5,27.5 48.5,27.5 52,27.5 43,33 60.5,21.4 15.2,32 70.2,61 21,44.5 19,44.5 10.9,66.9 45.4,57.4 67,30.5 64.5,53.5 55,40 58.5,60 48.5,63 28,62 56.5,28.5 61,28.5 76.2,24.1
  pour Bottom: 0,10.5 0,79 65,79 65,86 86,86 86,10.5
  pour Top (rank 2): 6,16 6,79 79.43,79 79.43,16 34.38,16 29.79,12.29 26.21,12.29 22.5,16
MAN  (via drill 0.51)
  Top 0.305: IC1.1 70.15,53.5 v69.3,53.5
  Top 0.61: SW1.P$3 32.54,28.46 v32.5,28.5 | v32.5,32 32.5,33.46 SW1.P$4 35.22,30.82 61.31,30.82 63.37,32.87 63.37,39.99 69.22,45.85 69.35,45.85 v69.5,46
  Bottom 0.61: v32.5,28.5 v32.5,32 | v69.5,46 | v69.3,53.5 69.3,46.2 v69.5,46
N$1
  Top 0.61: R18.2 R15.1
N$2
  Top 1.5: B1.~1 19.39,66.7 28.09,58 TR1.4
N$3
  Top 0.813: 39.85,47.15 39.85,46.03 IC2.10
  Top 1: L2.1 33.5,48.5 34,48 C17.2
  Top 1.016: C17.2 35.62,48.12 C15.2 38.88,48.12 39.85,47.15
N$4
  Top 0.61: R13.1 73,71.5 | 73,71.5 R14.2 | 73,71.5 71.5,71.5 71.11,71.89 71.11,75.4 Q2.1
N$5
  Top 0.61: R20.2 R17.1
N$6
  Top 0.61: Q4.G 15.95,25.2 20.74,25.2 Q3.3 21,22.7 21.2,22.7 R29.1
N$8
  Top 0.61: IC3.10 39.83,70.17 39.72,70.28
  Top 1: L3.1 34,71.5 34.5,71 C18.2
  Top 1.016: C18.2 35.62,71.12 C16.2 38.88,71.12 39.72,70.28
N$9  (via drill 0.51)
  Top 0.61: X1.1 76.93,69.3 D2.A | Q2.3 v69.5,72.5
  Bottom 0.61: X1.1 72.27,69.73 v69.5,72.5
N$10
  Top 1.5: B1.~2 20.61,69.3 25.79,64.12 43.97,64.12 45.35,62.74 45.35,62.56 51.03,56.88 54.38,56.88 TR1.3
N$11
  Top 0.61: R15.2 R10.1
N$12
  Top 0.61: 12.6,2.5 R10.2
  Top 1: TR1.1 29.5,84 2.95,84 2,83.05 2,10 2.5,9.5 7,9.5 7.5,9 7.5,3 7.9,2.6 R10.2 | F1.2 12.6,2.5
N$14
  Top 0.61: R16.2 R11.1
N$15
  Top 0.61: R17.2 R12.1
N$16  (via drill 0.51)
  Top 0.61: v75,41 74.8,40.8 B2.~1 | CT1.1 R2.2
  Bottom 0.61: v75,41 70.1,41 CT1.1
N$17
  Top 1.5: RL2.A1 43.6,17.85 D3.A | Q4.D 14.5,22.3
  Top 2: RL3.A1 D5.A | 14.5,22.3 14.5,17.9 D4.A RL1.A1
  Bottom 2: RL1.A1 28.97,17.85 31.73,15.09 40.65,15.09 43.42,17.85 RL2.A1 56.3,17.85 59.06,15.09 68.01,15.09 70.77,17.85 RL3.A1
N$19
  Top 0.61: R19.2 R16.1
N$20
  Top 0.406: U1.2 11.37,59.13 11.5,59
  Top 2: 15.75,54.05 L1.1
  pour Top (no thermals): 10.5,59.5 12,59.5 12.5,60 14,60 14,55 17,55 17,53 8.5,53 8.5,55 12,55 12,58.5 11.5,59 10.5,59
N$21
  Top 0.61: R8.1 11.05,37.4 13.85,34.6 | R9.2 13.85,34.6 | Q1.1 13.95,34.5 13.85,34.6
N$22
  Top 1: R11.2 43.63,2.6 F2.2
N$24
  Top 1: TR1.2 56.93,84 83,84 84,83 84,9 | 84,9 F3.2 | R12.2 83.6,8.6 84,9
N$25
  Top 0.61: Q3.1 21.95,27.95 22.4,28.4 C11.2 R28.2 R27.2
N$27  (via drill 0.51)
  Top 0.61: v75,36 74.8,35.8 B3.~1 | R4.2 50.4,35.5 CT2.1
  Bottom 0.61: CT2.1 55.75,27.15 67.39,27.15 68.25,26.29 70.25,26.29 71.31,27.35 71.31,32.31 v75,36
N$62  (via drill 0.51)
  Top 0.508: B4.~1 71.65,22.5 v70.5,22.5
  Top 0.61: R6.2 CT3.1
  Bottom 0.61: CT3.1 18.23,38.67 18.23,36.97 18.97,36.23 19.59,36.23 32.02,23.8 66,23.8 67.3,22.5 v70.5,22.5
R
  Top 1.5: F1.1 21.33,2.5 RL1.14
RA  (via drill 0.51)
  Top 0.305: IC1.11 76.12,62 77.06,62.94 77.06,63.5 v77,63.5
  Top 0.508: B4.~2 71,20.2 v70.5,20.7
  Top 0.61: CT3.2 R5.1
  Bottom 0.61: CT3.2 26.14,28.1 31.56,22.68 65.53,22.68 67.7,20.51 70.5,20.51 v70.5,20.7 74.63,24.83 74.63,31.34 77.39,34.09 77.39,37.73 79.5,39.84 79.5,50.16 76.53,53.13 76.53,54.1 76.53,58.18 77,58.65 v77,63.5
RELAY
  Top 0.305: IC1.8 74.83,51 75.27,50.56 75.27,50
  Top 0.61: 75.27,50 75.27,48.4 73.6,46.73 72.03,46.73 70.03,44.73 69.69,44.73 64.81,39.86 64.81,32.74 61.78,29.7 33.09,29.7 33.03,29.77 31.27,29.77 24.5,23 24.5,20 24.1,19.6 R29.2
RST  (via drill 0.51)
  Top 0.305: C14.1 67.5,58.1 69.91,58.1 71.26,56.75 77.52,56.75 JP1.3 | v77.8,54.6 77.25,55.33 74.11,55.33 73.53,54.75 IC1.6
  Bottom 0.305: JP1.3 77.69,56.92 77.69,54.91 v77.8,54.6
RV
  Top 0.305: IC1.9 75.47,51.52 76.38,50.62 76.38,50
  Top 0.61: R21.2 R22.1 | R22.1 R18.1 | 76.38,50 76.38,47.88 74.11,45.61 72.49,45.61 70.11,43.23 69.77,43.23 65.93,39.39 65.93,32.27 62.7,29.04 62.7,21.25 57.06,15.62 35.12,15.62 27.6,8.1 C5.2 R22.1
SCF  (via drill 0.51)
  Top 0.254: IC1.20 70.26,59.35 v69.3,59.3
  Top 0.61: B2.+ 77,38.2 | 77,38.2 77,33.18 | v19.5,37.5 19.6,37.4 R27.1 | v76,42.5 77,41.5 77,38.2 | 77,33.18 74.63,30.81 74.63,24.43 | B3.+ 79.53,33.18 77,33.18 | B4.+ 75.8,20.2 74.63,21.37 74.63,24.43 | v72.5,24.5 72.57,24.43 74.63,24.43
  Bottom 0.61: v69.3,59.3 71.35,59.35 73.18,57.53 73.18,51.74 76,48.92 v76,42.5 | v19.5,37.5 19.9,37.5 32.49,24.91 66.46,24.91 67.38,24 72,24 v72.5,24.5
SCK  (via drill 0.51)
  Top 0.305: IC1.17 72.22,60.53 68,64.76 v68,65.5
  Top 0.61: IC2.2 46.17,49.97 47.03,49.12 53.43,49.12 62.5,58.19 v62.5,65 62.15,65.35 55.77,65.35 54.62,66.5 54.62,69.91 54.56,69.97 54.56,71.06 52.05,73.56 46.78,73.56 46.17,74.17 IC3.2 | R32.1 68,65.9 v68,65.5
  Bottom 0.61: v68,65.5 67.5,65 v62.5,65
STOP  (via drill 0.51)
  Top 0.305: IC1.2 70.92,54.4 70.63,54.69 68.69,54.69 v68.3,54.5
  Top 0.61: SW2.P$3 45.54,27.61 v45.5,27.6 | v45.5,32 45.5,33.46 SW2.P$4 47.1,31.94 60.85,31.94 62.23,33.31 62.23,40.53 67.5,45.8 v67.5,46
  Bottom 0.61: v45.5,27.6 v45.5,32 | v68.3,54.5 68.3,54.3 68.03,54.03 68.03,46.53 v67.5,46
SWCLK
  Top 0.305: IC1.19 70.92,58.08 71.55,57.46 76.89,57.46 77.71,58.28 77.71,59.48 JP1.4
SWDIO
  Top 0.305: JP1.5 77,61.31 77,58.58 76.59,58.17 72,58.17 71.58,58.6 IC1.18
V_DIS  (via drill 0.51)
  Top 0.305: v69.5,65.5 69.5,64.66 72.88,61.28 IC1.16
  Top 0.61: IC3.3 44.91,73.86 46.32,72.44 50.5,72.44 53.5,69.44 53.5,66.04 56.04,63.5 v61,63.5 | R31.1 67,70.5 69.5,68 v69.5,65.5
  Bottom 0.61: v61,63.5 61.23,63.73 68.23,63.73 69.5,65 v69.5,65.5
VA
  Top 0.61: DS2.11 38.55,76.44 38.55,76 IC3.8 38.04,75.52 37.3,75.52 36.5,75.52 35.48,75.52 34,77 LED1.A
VB  (via drill 0.51)
  Top 0.508: IC3.9 38.45,69.1 v36,69
  Top 0.61: v36,69 35.05,68.05 33.93,68.11 30.83,68.11 28.77,70.17 LED2.A
  Bottom 0.61: DS2.7 50.35,76.08 50.35,74 49.23,72.88 43.09,72.88 43.09,72.89 41.04,72.89 37.15,69 v36,69
VC
  Top 0.406: 46.5,71.12 46.12,71.12 45.58,71.66 43.5,71.66 41.62,71.66 40.94,70.98 40.94,70.4 40.94,70.02 41.09,69.86 IC3.11
  Top 0.61: DS2.4 46.09,65.09 47.5,65.09 | 52,65.5 52,69 49.88,71.12 46.5,71.12 | 52,65.5 LED6.A | 52,65.5 51.59,65.09 47.5,65.09 | 47.5,65.09
VD  (via drill 0.51)
  Top 0.61: IC3.12 42.37,70.23 v42.1,70.5 | v39,62 38.77,61.77 LED4.A
  Bottom 0.61: v39,62 39.19,62.19 DS2.2 39.19,67.59 v42.1,70.5
VD1  (via drill 0.51)
  Top 0.61: IC3.1 v49,75
  Bottom 0.61: DS2.12 38.23,75.5 48.5,75.5 v49,75
VD2
  Top 0.406: IC3.5 42.37,75.61 43.83,77.08 DS2.9
VD3
  Top 0.305: 40.47,78.03 40.47,77.97 40.46,77.97
  Top 0.38: 40.46,76.25 40.46,77.97
  Top 0.406: IC3.6 41.09,75.64 40.81,75.91 40.46,76.25
  Top 0.61: 40.47,78.03 41.08,78.64 45.25,78.64 DS2.8
VD4  (via drill 0.51)
  Top 0.61: LED3.K LED2.K LED1.K | IC3.7 39.83,74.03 | LED5.K LED4.K
  Top 0.813: 39.83,74.03 v39.8,73.9
  Bottom 0.61: v39.8,73.9 39.88,74.02 37.5,74.02 32.87,78.65 28.09,78.65 26.43,77 LED1.K | LED4.K LED3.K | LED5.K LED6.K LED7.K LED8.K
VDP  (via drill 0.51)
  Top 0.61: v48.5,69 IC3.16
  Bottom 0.61: LED5.A 41.73,63.04 DS2.3 43.81,69 v48.5,69
VE  (via drill 0.51)
  Top 0.61: IC3.13 43.63,70.36 v43.6,70.5 | LED3.A 36.57,67 DS2.1
  Bottom 0.61: DS2.1 41.5,71.77 42.63,71.77 43.6,70.8 v43.6,70.5
VEE  (via drill 0.51)
  Top 0.508: U1.1 10.85,60.55 11.03,60.73
  Top 0.61: X1.2 76.93,72.7 D2.C 72.2,79 46.83,79 45.81,80.01 40,80.01 38.99,79 14.5,79 6.5,71 C1.+
  Top 1: v6.5,39.5 7.5,38.5 R7.1
  Top 1.016: 11.03,60.73 C3.2 9.5,60.68 6.5,57.68 C2.+
  Top 1.5: RL2.A2 36.53,17.9 D3.C
  Top 2: RL3.A2 D5.C | D4.C RL1.A2 | C1.+ 7.74,69.3 B1.+
  Bottom 0.61: 5.25,38.25 4.75,37.75
  Bottom 1: v6.5,39.5 5.25,38.25
  Bottom 2: RL3.A2 60.2,17.85 57.44,20.61 42.27,20.61 39.51,17.85 RL2.A2 32.88,17.85 30.11,20.61 16.5,20.61 13.73,17.85 10.5,17.85 | RL1.A2 10.5,17.85 | 2.5,57.5 2.5,40 4.75,37.75 12.06,30.44 12.06,25.06 10.5,23.5 10.5,17.85 | C2.+ 2.54,57.54 2.5,57.5 | C1.+ 2.5,66.54 2.5,57.5
VF  (via drill 0.51)
  Top 0.61: IC3.14 44.91,70.41 v45.1,70.5
  Bottom 0.61: DS2.10 43.29,78.64 50,78.64 51.41,77.23 51.41,71.66 51.5,71.57 | v45.1,70.5 46.17,71.57 51.5,71.57 | 51.5,71.57 56.8,71.57 LED8.A
VG
  Top 0.61: IC3.15 46.17,67.56 DS2.5
  Bottom 0.61: LED7.A 46.89,67 DS2.5
Y
  Top 1.5: F2.1 50.33,2.5 RL2.14
YA  (via drill 0.51)
  Top 0.305: IC1.12 75.47,62.64 75.5,62.67 v75.5,64
  Top 0.61: v75,33.5 74.7,33.2 B3.~2 | R3.1 35.6,35.5 CT2.2
  Bottom 0.61: CT2.2 45.07,26.03 66.92,26.03 67.79,25.17 71.21,25.17 72.93,26.89 72.93,31.43 v75,33.5 76.27,34.77 76.27,38.19 78.39,40.31 78.39,49.69 75.41,52.67 75.41,58.64 75.5,58.73 v75.5,64
YV
  Top 0.305: IC1.10 76.12,51.88 77.5,50.5 77.5,50
  Top 0.61: 77.5,50 77.5,47.42 74.58,44.49 72.95,44.49 70.92,42.46 70.92,27.46 69.75,26.29 69.31,26.29 60.73,17.71 60.73,12.23 56.6,8.1 C6.2 R24.1 R23.1 R19.1

### Text on the board
bNames: BT AQ DOL STTM R1